# Altium project MiniPowerModule.PrjPcb
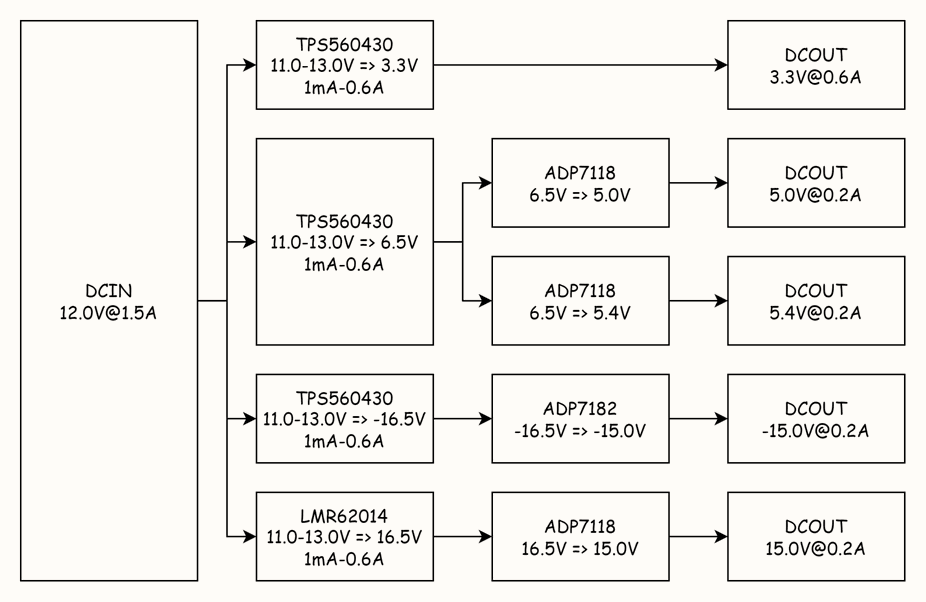
[diagram p0: MiniPowerModule.SchDoc]
10 sheets, 91 parts. Net scope: global (net labels, ports and power ports of the same name join across sheets).
Board file: MiniPowerModule.PcbDoc
Sheets:
  MiniPowerModule.SchDoc
  Connector.SchDoc
  Dcdc.12V0.+3V3.SchDoc
  Dcdc.12V0.+6V5.SchDoc
  Dcdc.12V0.-16V5.SchDoc
  Dcdc.12V0.+16V5.SchDoc
  Ldo.+6V5.+5V0.SchDoc
  Ldo.+6V5.+5V4.SchDoc
  Ldo.-16V5.-15V0.SchDoc
  Ldo.+16V5.+15V0.SchDoc

## Sheet MiniPowerModule.SchDoc
size A4

## Sheet Connector.SchDoc
size A4
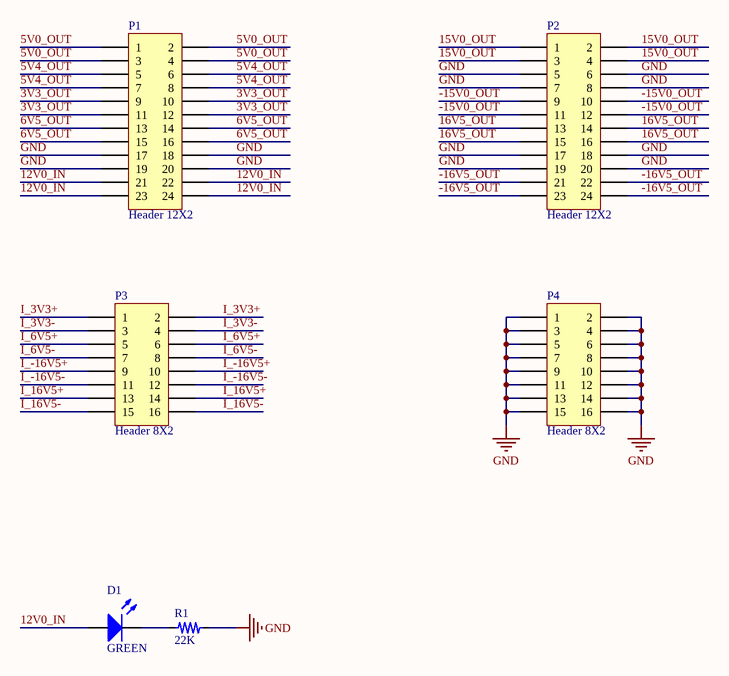
[diagram p1: Connector.SchDoc]

### Parts
D1  value GREEN  [LED0603]  (hidden comment: LED)
P1  Header 12X2  [HDR2X12]
P2  Header 12X2  [HDR2X12]
P3  Header 8X2  [HDR2X8]
P4  Header 8X2  [HDR2X8]
R1  value 22K  [R0603]  (hidden comment: Res)

### Nets
GND: P1.17 P1.18 P1.19 P1.20 P2.5 P2.6 P2.7 P2.8 P2.17 P2.18 P2.19 P2.20 P4.1 P4.2 P4.3 P4.4 P4.5 P4.6 P4.7 P4.8 P4.9 P4.10 P4.11 P4.12 P4.13 P4.14 P4.15 P4.16 R1.1
3V3_OUT: P1.9 P1.10 P1.11 P1.12 P3.3 P3.4  [also labelled I_3V3-]
5V0_OUT: P1.1 P1.2 P1.3 P1.4
5V4_OUT: P1.5 P1.6 P1.7 P1.8
6V5_OUT: P1.13 P1.14 P1.15 P1.16 P3.7 P3.8  [also labelled I_6V5-]
12V0_IN: D1.1(A) P1.21 P1.22 P1.23 P1.24
15V0_OUT: P2.1 P2.2 P2.3 P2.4
16V5_OUT: P2.13 P2.14 P2.15 P2.16 P3.15 P3.16  [also labelled I_16V5-]
-15V0_OUT: P2.9 P2.10 P2.11 P2.12
-16V5_OUT: P2.21 P2.22 P2.23 P2.24 P3.9 P3.10  [also labelled I_-16V5+]
I_3V3+: P3.1 P3.2
I_6V5+: P3.5 P3.6
I_16V5+: P3.13 P3.14
I_-16V5-: P3.11 P3.12
NetD1_2: D1.2(K) R1.2

### Library data of the parts
P1 P2 = Header 12X2: Header, 12-Pin, Dual row
P3 P4 = Header 8X2: Header, 8-Pin, Dual row
R1 = Res: 电阻

## Sheet Dcdc.12V0.+3V3.SchDoc
size A4
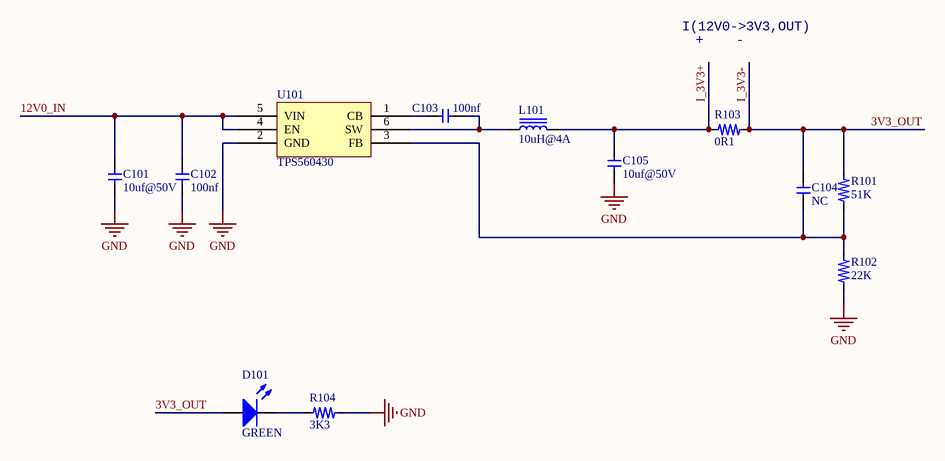
[diagram p2: Dcdc.12V0.+3V3.SchDoc]

### Parts
C101  value 10uf@50V  [C1210]  (hidden comment: Cap)
C102  value 100nf  [C0603]  (hidden comment: Cap)
C103  value 100nf  [C0603]  (hidden comment: Cap)
C104  value NC  [C0603]  (hidden comment: Cap)
C105  value 10uf@50V  [C1210]  (hidden comment: Cap)
D101  value GREEN  [LED0603]  (hidden comment: LED)
L101  value 10uH@4A  [L06063]  (hidden comment: Inductor Iron)
R101  value 51K  [R0603]  (hidden comment: Res)
R102  value 22K  [R0603]  (hidden comment: Res)
R103  value 0R1  [R1206]  (hidden comment: Res)
R104  value 3K3  [R0603]  (hidden comment: Res)
U101  TPS560430  [TPS560430-SOT23-6]

### Nets
GND: C101.1 C102.1 C105.1 R102.1 R104.1 U101.2(GND)
3V3_OUT: C104.1 D101.1(A) R101.2 R103.2  [also labelled I_3V3-]
12V0_IN: C101.2 C102.2 U101.4(EN) U101.5(VIN)
I_3V3+: C105.2 L101.2 R103.1
NetC103_1: C103.1 L101.1 U101.6(SW)
NetC103_2: C103.2 U101.1(CB)
NetC104_2: C104.2 R101.1 R102.2 U101.3(FB)
NetD101_2: D101.2(K) R104.2

### Notes on the sheet
- I(12V0->3V3,OUT)
- +
- -

### Library data of the parts
L101 = Inductor Iron: Magnetic-Core Inductor
R101-R104 = Res: 电阻
U101 = TPS560430: TPS560430 SIMPLE SWITCHER® 4-V to 36-V, 600-mA Synchronous Step-Down Converter

## Sheet Dcdc.12V0.+6V5.SchDoc
size A4
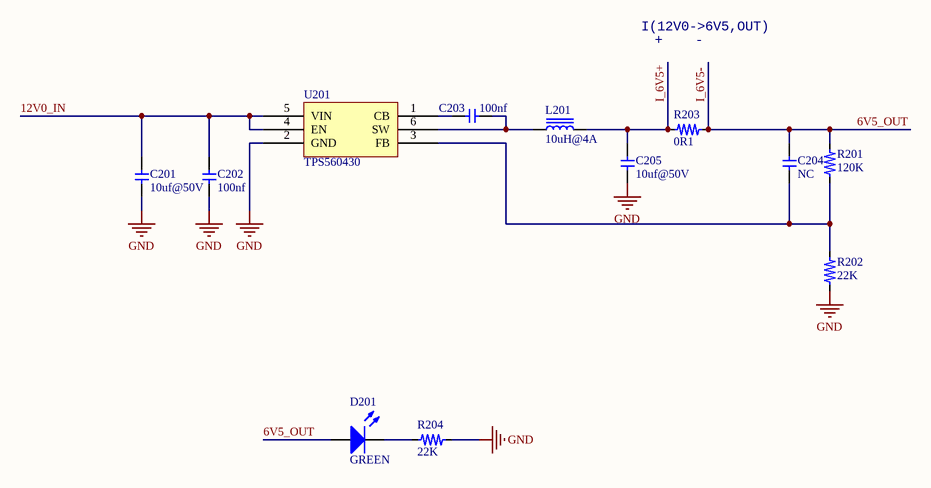
[diagram p3: Dcdc.12V0.+6V5.SchDoc]

### Parts
C201  value 10uf@50V  [C1210]  (hidden comment: Cap)
C202  value 100nf  [C0603]  (hidden comment: Cap)
C203  value 100nf  [C0603]  (hidden comment: Cap)
C204  value NC  [C0603]  (hidden comment: Cap)
C205  value 10uf@50V  [C1210]  (hidden comment: Cap)
D201  value GREEN  [LED0603]  (hidden comment: LED)
L201  value 10uH@4A  [L06063]  (hidden comment: Inductor Iron)
R201  value 120K  [R0603]  (hidden comment: Res)
R202  value 22K  [R0603]  (hidden comment: Res)
R203  value 0R1  [R1206]  (hidden comment: Res)
R204  value 22K  [R0603]  (hidden comment: Res)
U201  TPS560430  [TPS560430-SOT23-6]

### Nets
GND: C201.1 C202.1 C205.1 R202.1 R204.1 U201.2(GND)
6V5_OUT: C204.1 D201.1(A) R201.2 R203.2  [also labelled I_6V5-]
12V0_IN: C201.2 C202.2 U201.4(EN) U201.5(VIN)
I_6V5+: C205.2 L201.2 R203.1
NetC203_1: C203.1 L201.1 U201.6(SW)
NetC203_2: C203.2 U201.1(CB)
NetC204_2: C204.2 R201.1 R202.2 U201.3(FB)
NetD201_2: D201.2(K) R204.2

### Notes on the sheet
- I(12V0->6V5,OUT)
- +
- -

### Library data of the parts
L201 = Inductor Iron: Magnetic-Core Inductor
R201-R204 = Res: 电阻
U201 = TPS560430: as U101 on sheet Dcdc.12V0.+3V3

## Sheet Dcdc.12V0.-16V5.SchDoc
size A4
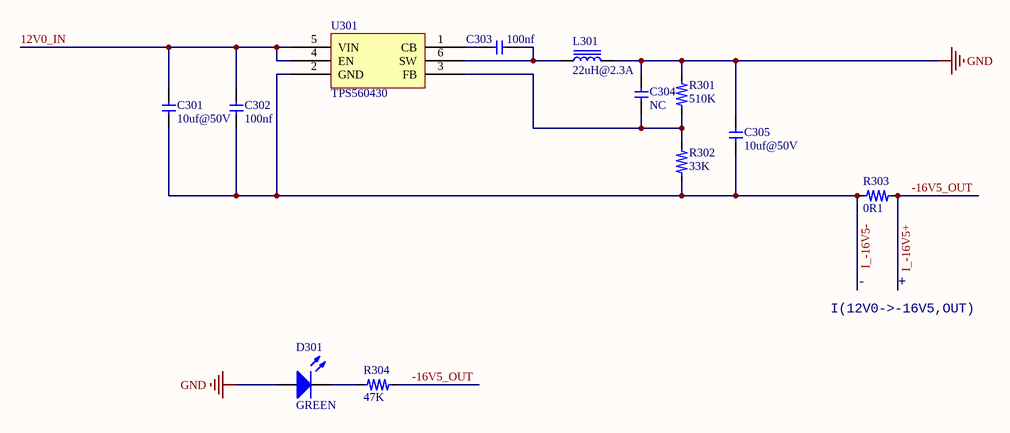
[diagram p4: Dcdc.12V0.-16V5.SchDoc]

### Parts
C301  value 10uf@50V  [C1210]  (hidden comment: Cap)
C302  value 100nf  [C0603]  (hidden comment: Cap)
C303  value 100nf  [C0603]  (hidden comment: Cap)
C304  value NC  [C0603]  (hidden comment: Cap)
C305  value 10uf@50V  [C1210]  (hidden comment: Cap)
D301  value GREEN  [LED0603]  (hidden comment: LED)
L301  value 22uH@2.3A  [L06063]  (hidden comment: Inductor Iron)
R301  value 510K  [R0603]  (hidden comment: Res)
R302  value 33K  [R0603]  (hidden comment: Res)
R303  value 0R1  [R1206]  (hidden comment: Res)
R304  value 47K  [R0603]  (hidden comment: Res)
U301  TPS560430  [TPS560430-SOT23-6]

### Nets
GND: C304.1 C305.2 D301.1(A) L301.2 R301.2
12V0_IN: C301.2 C302.2 U301.4(EN) U301.5(VIN)
-16V5_OUT: R303.1 R304.1  [also labelled I_-16V5+]
I_-16V5-: C301.1 C302.1 C305.1 R302.1 R303.2 U301.2(GND)
NetC303_1: C303.1 L301.1 U301.6(SW)
NetC303_2: C303.2 U301.1(CB)
NetC304_2: C304.2 R301.1 R302.2 U301.3(FB)
NetD301_2: D301.2(K) R304.2

### Notes on the sheet
- I(12V0->-16V5,OUT)
- -
- +

### Library data of the parts
L301 = Inductor Iron: Magnetic-Core Inductor
R301-R304 = Res: 电阻
U301 = TPS560430: as U101 on sheet Dcdc.12V0.+3V3

## Sheet Dcdc.12V0.+16V5.SchDoc
size A4
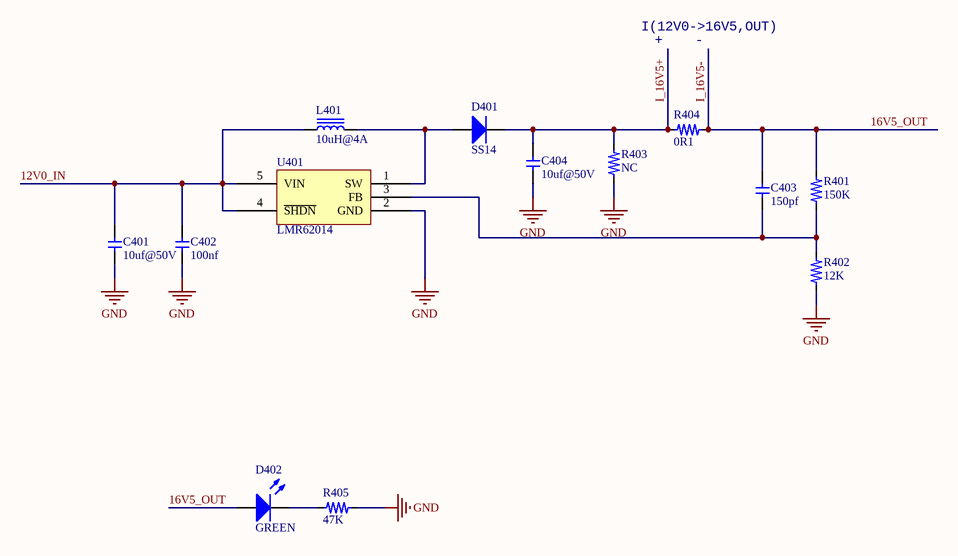
[diagram p5: Dcdc.12V0.+16V5.SchDoc]

### Parts
C401  value 10uf@50V  [C1210]  (hidden comment: Cap)
C402  value 100nf  [C0603]  (hidden comment: Cap)
C403  value 150pf  [C0603]  (hidden comment: Cap)
C404  value 10uf@50V  [C1210]  (hidden comment: Cap)
D401  value SS14  [DIODE-SMAF]  (hidden comment: Diode)
D402  value GREEN  [LED0603]  (hidden comment: LED)
L401  value 10uH@4A  [L06063]  (hidden comment: Inductor Iron)
R401  value 150K  [R0603]  (hidden comment: Res)
R402  value 12K  [R0603]  (hidden comment: Res)
R403  value NC  [R1210]  (hidden comment: Res)
R404  value 0R1  [R1206]  (hidden comment: Res)
R405  value 47K  [R0603]  (hidden comment: Res)
U401  LMR62014  [LMR62014-SOT23-5]

### Nets
GND: C401.1 C402.1 C404.1 R402.1 R403.1 R405.1 U401.2(GND)
12V0_IN: C401.2 C402.2 L401.1 U401.4(~{SHDN}) U401.5(VIN)
16V5_OUT: C403.1 D402.1(A) R401.2 R404.2  [also labelled I_16V5-]
I_16V5+: C404.2 D401.2(K) R403.2 R404.1
NetC403_2: C403.2 R401.1 R402.2 U401.3(FB)
NetD401_1: D401.1(A) L401.2 U401.1(SW)
NetD402_2: D402.2(K) R405.2

### Notes on the sheet
- I(12V0->16V5,OUT)
- +
- -

### Library data of the parts
D401 = Diode: 通用二极管
L401 = Inductor Iron: Magnetic-Core Inductor
R401-R405 = Res: 电阻
U401 = LMR62014: LMR62014 SIMPLE SWITCHER® 20Vout, 1.4A Step-Up Voltage Regulator in SOT-23

## Sheet Ldo.+6V5.+5V0.SchDoc
size A4
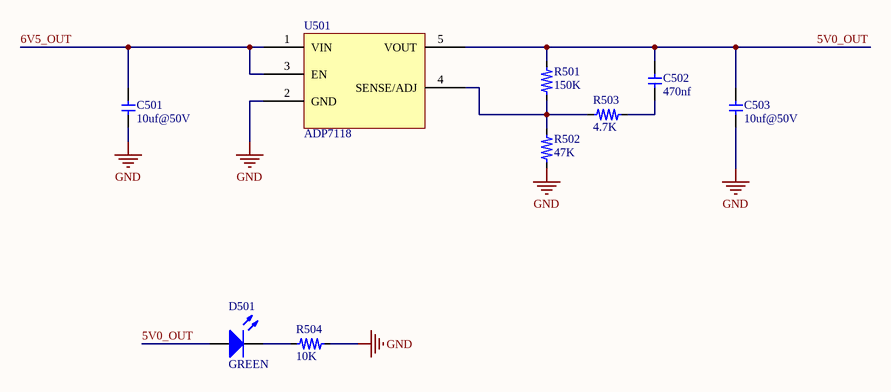
[diagram p6: Ldo.+6V5.+5V0.SchDoc]

### Parts
C501  value 10uf@50V  [C1210]  (hidden comment: Cap)
C502  value 470nf  [C0603]  (hidden comment: Cap)
C503  value 10uf@50V  [C1210]  (hidden comment: Cap)
D501  value GREEN  [LED0603]  (hidden comment: LED)
R501  value 150K  [R0603]  (hidden comment: Res)
R502  value 47K  [R0603]  (hidden comment: Res)
R503  value 4.7K  [R0603]  (hidden comment: Res)
R504  value 10K  [R0603]  (hidden comment: Res)
U501  ADP7118  [ADP7118-TSOT5]

### Nets
GND: C501.1 C503.1 R502.1 R504.1 U501.2(GND)
5V0_OUT: C502.1 C503.2 D501.1(A) R501.2 U501.5(VOUT)
6V5_OUT: C501.2 U501.1(VIN) U501.3(EN)
NetC502_2: C502.2 R503.1
NetD501_2: D501.2(K) R504.2
NetR501_1: R501.1 R502.2 R503.2 U501.4(SENSE/ADJ)

### Library data of the parts
R501-R504 = Res: 电阻
U501 = ADP7118AUJ: 20 V, 200 mA, Low Noise,CMOS LDO Linear Regulator.

## Sheet Ldo.+6V5.+5V4.SchDoc
size A4
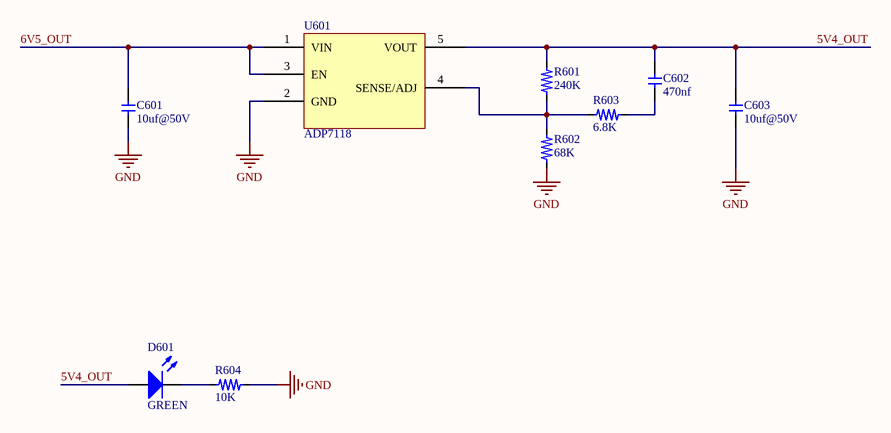
[diagram p7: Ldo.+6V5.+5V4.SchDoc]

### Parts
C601  value 10uf@50V  [C1210]  (hidden comment: Cap)
C602  value 470nf  [C0603]  (hidden comment: Cap)
C603  value 10uf@50V  [C1210]  (hidden comment: Cap)
D601  value GREEN  [LED0603]  (hidden comment: LED)
R601  value 240K  [R0603]  (hidden comment: Res)
R602  value 68K  [R0603]  (hidden comment: Res)
R603  value 6.8K  [R0603]  (hidden comment: Res)
R604  value 10K  [R0603]  (hidden comment: Res)
U601  ADP7118  [ADP7118-TSOT5]

### Nets
GND: C601.1 C603.1 R602.1 R604.1 U601.2(GND)
5V4_OUT: C602.1 C603.2 D601.1(A) R601.2 U601.5(VOUT)
6V5_OUT: C601.2 U601.1(VIN) U601.3(EN)
NetC602_2: C602.2 R603.1
NetD601_2: D601.2(K) R604.2
NetR601_1: R601.1 R602.2 R603.2 U601.4(SENSE/ADJ)

### Library data of the parts
R601-R604 = Res: 电阻
U601 = ADP7118AUJ: as U501 on sheet Ldo.+6V5.+5V0

## Sheet Ldo.-16V5.-15V0.SchDoc
size A4
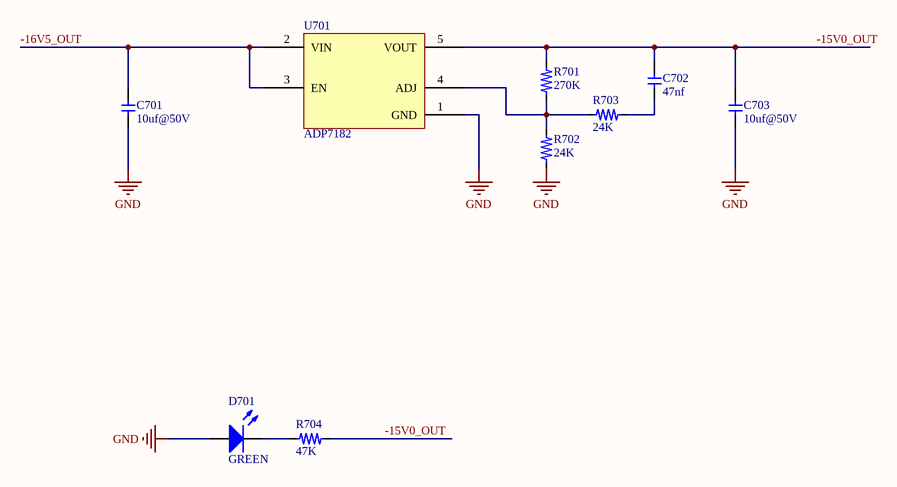
[diagram p8: Ldo.-16V5.-15V0.SchDoc]

### Parts
C701  value 10uf@50V  [C1210]  (hidden comment: Cap)
C702  value 47nf  [C0603]  (hidden comment: Cap)
C703  value 10uf@50V  [C1210]  (hidden comment: Cap)
D701  value GREEN  [LED0603]  (hidden comment: LED)
R701  value 270K  [R0603]  (hidden comment: Res)
R702  value 24K  [R0603]  (hidden comment: Res)
R703  value 24K  [R0603]  (hidden comment: Res)
R704  value 47K  [R0603]  (hidden comment: Res)
U701  ADP7182  [ADP7182-TSOT5]

### Nets
GND: C701.1 C703.1 D701.1(A) R702.1 U701.1(GND)
-15V0_OUT: C702.1 C703.2 R701.2 R704.1 U701.5(VOUT)
-16V5_OUT: C701.2 U701.2(VIN) U701.3(EN)
NetC702_2: C702.2 R703.1
NetD701_2: D701.2(K) R704.2
NetR701_1: R701.1 R702.2 R703.2 U701.4(ADJ)

### Library data of the parts
R701-R704 = Res: 电阻
U701 = ADP7182AUJ: –28 V, −200 mA, Low Noise, Linear Regulator

## Sheet Ldo.+16V5.+15V0.SchDoc
size A4
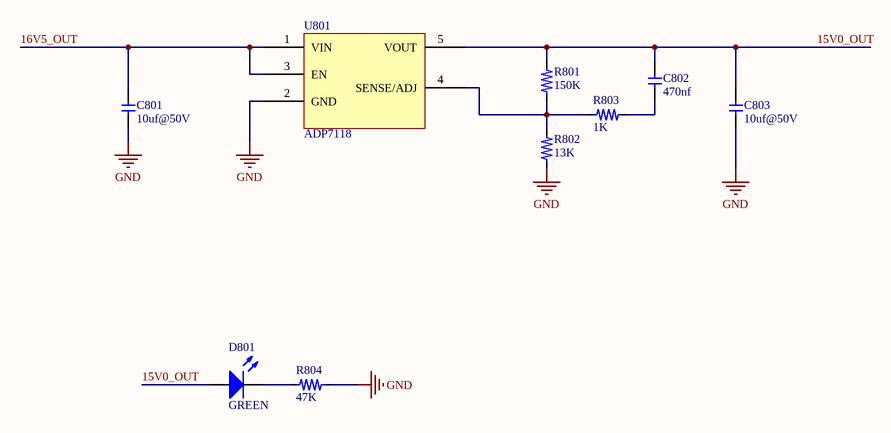
[diagram p9: Ldo.+16V5.+15V0.SchDoc]

### Parts
C801  value 10uf@50V  [C1210]  (hidden comment: Cap)
C802  value 470nf  [C0603]  (hidden comment: Cap)
C803  value 10uf@50V  [C1210]  (hidden comment: Cap)
D801  value GREEN  [LED0603]  (hidden comment: LED)
R801  value 150K  [R0603]  (hidden comment: Res)
R802  value 13K  [R0603]  (hidden comment: Res)
R803  value 1K  [R0603]  (hidden comment: Res)
R804  value 47K  [R0603]  (hidden comment: Res)
U801  ADP7118  [ADP7118-TSOT5]

### Nets
GND: C801.1 C803.1 R802.1 R804.1 U801.2(GND)
15V0_OUT: C802.1 C803.2 D801.1(A) R801.2 U801.5(VOUT)
16V5_OUT: C801.2 U801.1(VIN) U801.3(EN)
NetC802_2: C802.2 R803.1
NetD801_2: D801.2(K) R804.2
NetR801_1: R801.1 R802.2 R803.2 U801.4(SENSE/ADJ)

### Library data of the parts
R801-R804 = Res: 电阻
U801 = ADP7118AUJ: as U501 on sheet Ldo.+6V5.+5V0

## Nets that join several sheets
GND: Connector (29 pins), Dcdc.12V0.+3V3 (6 pins), Dcdc.12V0.+6V5 (6 pins), Dcdc.12V0.-16V5 (5 pins), Dcdc.12V0.+16V5 (7 pins), Ldo.+6V5.+5V0 (5 pins), Ldo.+6V5.+5V4 (5 pins), Ldo.-16V5.-15V0 (5 pins), Ldo.+16V5.+15V0 (5 pins)
3V3_OUT: Connector (6 pins), Dcdc.12V0.+3V3 (C104.1 D101.1 R101.2 R103.2)
5V0_OUT: Connector (P1.1 P1.2 P1.3 P1.4), Ldo.+6V5.+5V0 (5 pins)
5V4_OUT: Connector (P1.5 P1.6 P1.7 P1.8), Ldo.+6V5.+5V4 (5 pins)
6V5_OUT: Connector (6 pins), Dcdc.12V0.+6V5 (C204.1 D201.1 R201.2 R203.2), Ldo.+6V5.+5V0 (C501.2 U501.1 U501.3), Ldo.+6V5.+5V4 (C601.2 U601.1 U601.3)
12V0_IN: Connector (5 pins), Dcdc.12V0.+3V3 (C101.2 C102.2 U101.4 U101.5), Dcdc.12V0.+6V5 (C201.2 C202.2 U201.4 U201.5), Dcdc.12V0.-16V5 (C301.2 C302.2 U301.4 U301.5), Dcdc.12V0.+16V5 (5 pins)
15V0_OUT: Connector (P2.1 P2.2 P2.3 P2.4), Ldo.+16V5.+15V0 (5 pins)
16V5_OUT: Connector (6 pins), Dcdc.12V0.+16V5 (C403.1 D402.1 R401.2 R404.2), Ldo.+16V5.+15V0 (C801.2 U801.1 U801.3)
-15V0_OUT: Connector (P2.9 P2.10 P2.11 P2.12), Ldo.-16V5.-15V0 (5 pins)
-16V5_OUT: Connector (6 pins), Dcdc.12V0.-16V5 (R303.1 R304.1), Ldo.-16V5.-15V0 (C701.2 U701.2 U701.3)
I_3V3+: Connector (P3.1 P3.2), Dcdc.12V0.+3V3 (C105.2 L101.2 R103.1)
I_6V5+: Connector (P3.5 P3.6), Dcdc.12V0.+6V5 (C205.2 L201.2 R203.1)
I_16V5+: Connector (P3.13 P3.14), Dcdc.12V0.+16V5 (C404.2 D401.2 R403.2 R404.1)
I_-16V5-: Connector (P3.11 P3.12), Dcdc.12V0.-16V5 (6 pins)